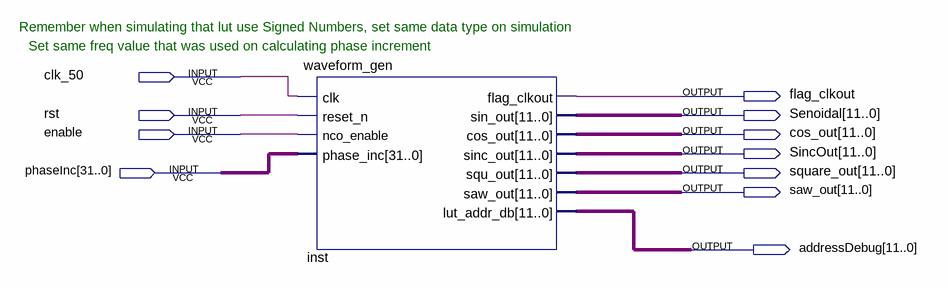
[diagram p0: schematic sheet]
// Quartus schematic nco_blockTest.bdf as structural Verilog: 1 symbols, 11 pins
module nco_blockTest (
  input  clk_50,
  input  rst,
  input  enable,
  input  [31:0] phaseInc,
  output flag_clkout,
  output [11:0] Senoidal,
  output [11:0] cos_out,
  output [11:0] SincOut,
  output [11:0] square_out,
  output [11:0] saw_out,
  output [11:0] addressDebug
);

  waveform_gen inst (
    .clk(clk_50), .reset_n(rst), .nco_enable(enable), .phase_inc(phaseInc), .flag_clkout(flag_clkout),
    .sin_out(Senoidal), .cos_out(cos_out), .sinc_out(SincOut), .squ_out(square_out), .saw_out(saw_out),
    .lut_addr_db(addressDebug));

  // Notes on the sheet:
  //   Remember when simulating that lut use Signed Numbers, set same data type on simulation
  //   Set same freq value that was used on calculating phase increment
endmodule
